# Altium project ESP32 MEGA.PrjPcb
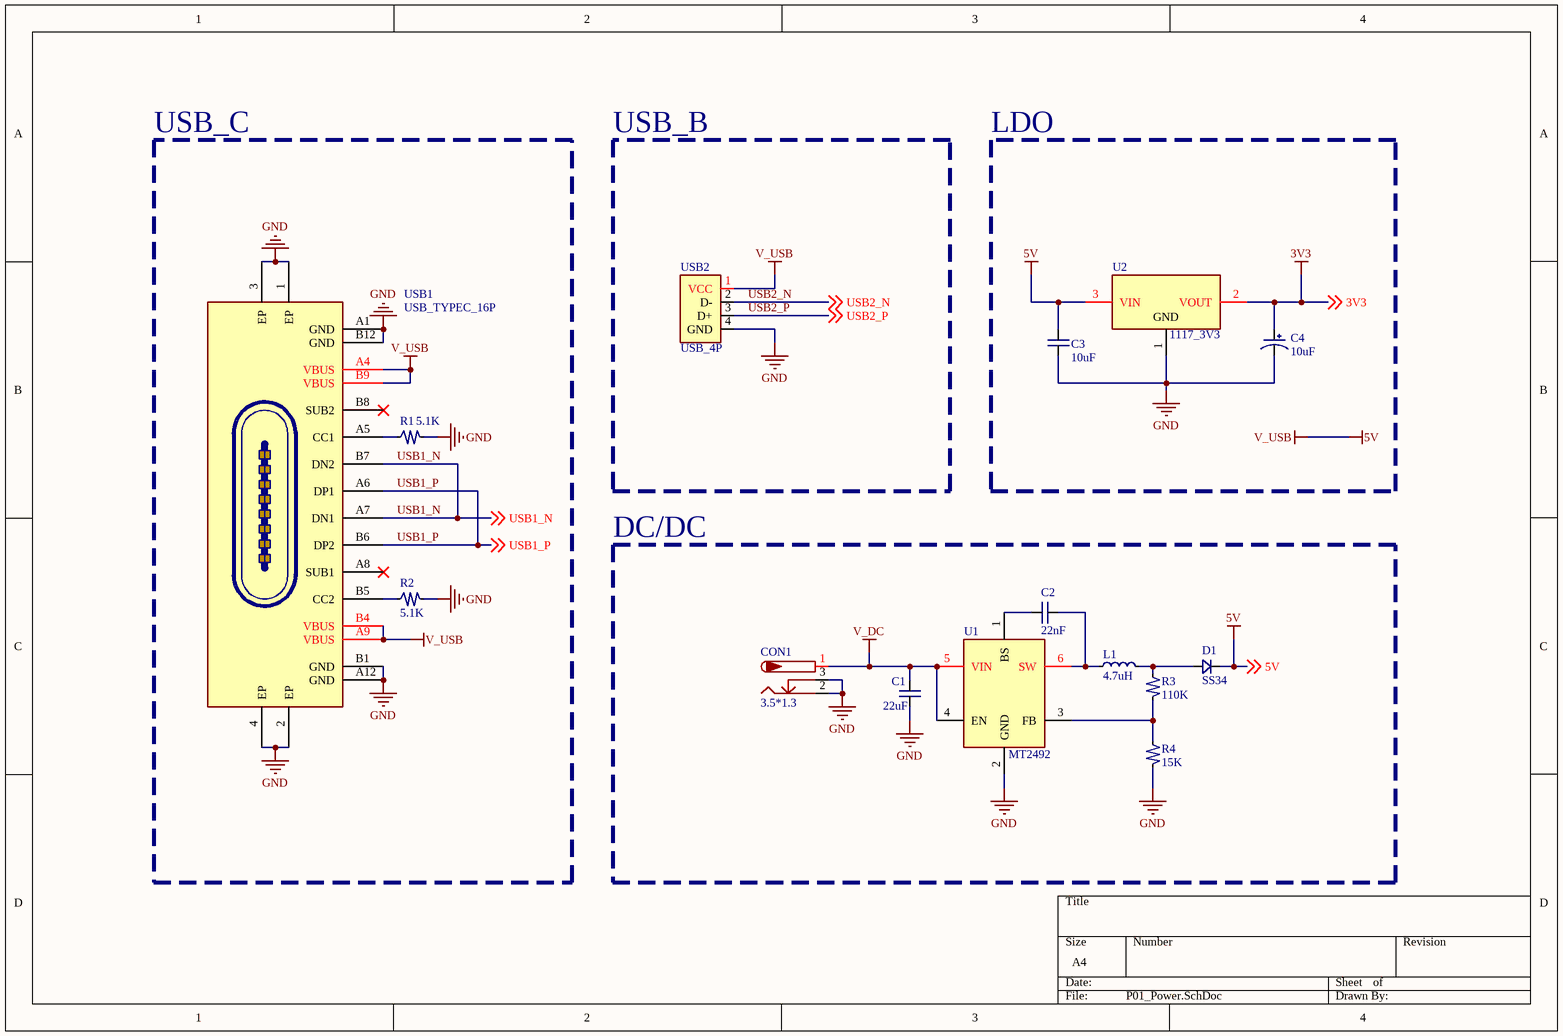
[diagram p0: P01_Power.SchDoc]
3 sheets, 64 parts. Net scope: global (net labels, ports and power ports of the same name join across sheets).
Board file: PCB.PcbDoc
Sheets:
  P01_Power.SchDoc
  P02_MCU.SchDoc
  P03_Connectors.SchDoc

## Sheet P01_Power.SchDoc
size A4; SheetNumber: 1; SheetTotal: 3

### Parts
C1  22uF  [C_0603]
C2  22nF  [C_0603]
C3  10uF  [C_0805]
C4  10uF  [CASE-A-3216]
CON1  3.5*1.3  [DC_Input]
D1  SS34  [SMA]
L1  4.7uH  [L_SMD0420]
R1  5.1K  [R_0402]
R2  5.1K  [R_0402]
R3  110K  [R_0603]
R4  15K  [R_0603]
U1  MT2492  [SOT-23-6]
U2  1117_3V3  [SOT-223]
USB1  USB_TYPEC_16P  [USB_TYPEC_16P]
USB2  USB_4P  [USB_TYPEB_4P]

### Blocks framed on the sheet
USB_C: R1 R2 USB1
USB_B: USB2
LDO: C3 C4 U2
DC/DC: C1 C2 CON1 D1 L1 R3 R4 U1

### Nets
3V3: C4.1 U2.2(VOUT) ; off-sheet 3V3
5V: C3.1 D1.1 U2.3(VIN) USB1.A4(VBUS) USB1.A9(VBUS) USB1.B4(VBUS) USB1.B9(VBUS) USB2.1(VCC) ; off-sheet 5V  [also labelled V_USB]
GND: C1.1 C3.2 C4.2 CON1.2 CON1.3 R1.1 R2.1 R4.1 U1.2(GND) U2.1(GND) USB1.1(EP) USB1.2(EP) USB1.3(EP) USB1.4(EP) USB1.A1(GND) USB1.A12(GND) USB1.B1(GND) USB1.B12(GND) USB2.4(GND)
V_DC: C1.2 CON1.1 U1.4(EN) U1.5(VIN)
USB1_N: USB1.A7(DN1) USB1.B7(DN2) ; off-sheet USB1_N  [project net GPIO19]
USB1_P: USB1.A6(DP1) USB1.B6(DP2) ; off-sheet USB1_P  [project net GPIO20]
USB2_N: USB2.2(D-) ; off-sheet USB2_N
USB2_P: USB2.3(D+) ; off-sheet USB2_P
NetC2_1: C2.1 U1.1(BS)
NetC2_2: C2.2 L1.2 U1.6(SW)
NetD1_2: D1.2 L1.1 R3.2
NetR1_2: R1.2 USB1.A5(CC1)
NetR2_2: R2.2 USB1.B5(CC2)
NetR3_1: R3.1 R4.2 U1.3(FB)

Not connected (* = marked no-connect by the designer): USB1 A8(SUB1)* B8(SUB2)*

### Library data of the parts
C1-C3 = C: 无极性电容
C4 = C_P: 极性电容
CON1 = DC_Input: 低压电源接口
D1 = D: 二极管
L1 = L: 电感
R1-R4 = R: 电阻
U1 = MT2492: 降压DC/DC / https://atta.szlcsc.com/upload/public/pdf/source/20221209/5C81DA9662873D3A116170FFBF63E49D.pdf
U2 = 1117_3V3: LDO to 3V3
USB1 = USB_TYPEC_16P: USB母座，TYPEC，16P
USB2 = USB_4Pin: USB母座, 4P

## Sheet P02_MCU.SchDoc
size A4; SheetNumber: 2; SheetTotal: 3
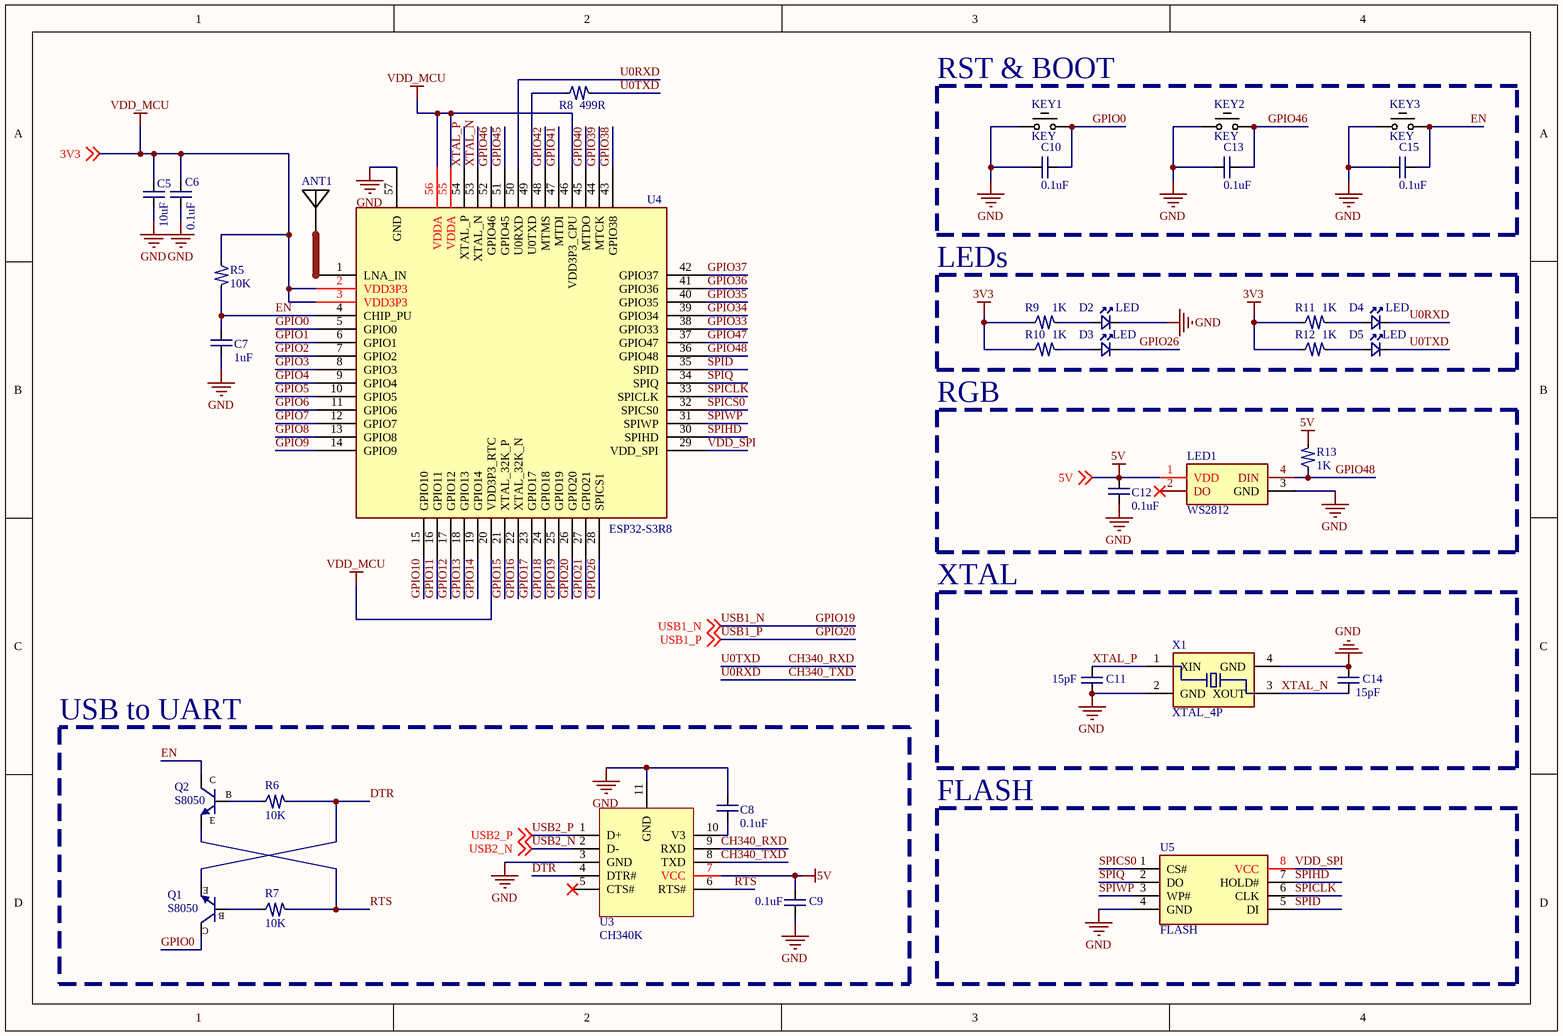
[diagram p1: P02_MCU.SchDoc]

### Parts
ANT1  ANT  [CrossAir_CAC03]  (value not drawn)
C5  10uF  [C_0402]
C6  0.1uF  [C_0402]
C7  1uF  [C_0402]
C8  0.1uF  [C_0603]
C9  0.1uF  [C_0603]
C10  0.1uF  [C_0603]
C11  15pF  [C_0402]
C12  0.1uF  [C_0603]
C13  0.1uF  [C_0603]
C14  15pF  [C_0402]
C15  0.1uF  [C_0603]
D2  LED  [LED_0603]
D3  LED  [LED_0603]
D4  LED  [LED_0603]
D5  LED  [LED_0603]
KEY1  KEY  [KEY]
KEY2  KEY  [KEY]
KEY3  KEY  [KEY]
LED1  WS2812  [SMD5050]
Q1  S8050  [SOT-23-3]
Q2  S8050  [SOT-23-3]
R5  10K  [R_0402]
R6  10K  [R_0603]
R7  10K  [R_0603]
R8  499R  [R_0402]
R9  1K  [R_0603]
R10  1K  [R_0603]
R11  1K  [R_0603]
R12  1K  [R_0603]
R13  1K  [R_0603]
U3  CH340K  [ESOP-10]
U4  ESP32-S3R8  [QFN-56]
U5  FLASH  [SOIC-8-208mil]
X1  XTAL_4P  [X_SMD3225]

### Blocks framed on the sheet
RST & BOOT: C10 C13 C15 KEY1-KEY3
LEDs: D2-D5 R9-R12
RGB: C12 LED1 R13
XTAL: C11 C14 X1
USB to UART: C8 C9 Q1 Q2 R6 R7 U3
FLASH: U5

### Nets
3V3: C5.1 C6.1 R5.2 R9.2 R10.2 R11.2 R12.2 U4.2(VDD3P3) U4.3(VDD3P3) U4.20(VDD3P3_RTC) U4.46(VDD3P3_CPU) U4.55(VDDA) U4.56(VDDA) ; off-sheet 3V3  [also labelled VDD_MCU]
5V: C9.2 C12.2 LED1.1(VDD) R13.1 U3.7(VCC) ; off-sheet 5V
GND: C5.2 C6.2 C7.1 C8.1 C9.1 C10.2 C11.1 C12.1 C13.2 C14.2 C15.2 D2.1 KEY1.2 KEY2.2 KEY3.2 LED1.3(GND) U3.3(GND) U3.11(GND) U4.57(GND) U5.4(GND) X1.2(GND) X1.4(GND)
CH340_RXD: D5.1 R8.1 U3.9(RXD)  [also labelled U0TXD]
CH340_TXD: D4.1 U3.8(TXD) U4.50(U0RXD)  [also labelled U0RXD]
DTR: Q1.2(E) R6.1 U3.4(DTR#)
EN: C7.2 C15.1 KEY3.1 Q2.3(C) R5.1 U4.4(CHIP_PU)
GPIO0: C10.1 KEY1.1 Q1.3(C) U4.5(GPIO0)
GPIO1: U4.6(GPIO1)
GPIO2: U4.7(GPIO2)
GPIO3: U4.8(GPIO3)
GPIO4: U4.9(GPIO4)
GPIO5: U4.10(GPIO5)
GPIO6: U4.11(GPIO6)
GPIO7: U4.12(GPIO7)
GPIO8: U4.13(GPIO8)
GPIO9: U4.14(GPIO9)
GPIO10: U4.15(GPIO10)
GPIO11: U4.16(GPIO11)
GPIO12: U4.17(GPIO12)
GPIO13: U4.18(GPIO13)
GPIO14: U4.19(GPIO14)
GPIO15: U4.21(XTAL_32K_P)
GPIO16: U4.22(XTAL_32K_N)
GPIO17: U4.23(GPIO17)
GPIO18: U4.24(GPIO18)
GPIO19: U4.25(GPIO19) ; off-sheet USB1_N  [also labelled USB1_N]
GPIO20: U4.26(GPIO20) ; off-sheet USB1_P  [also labelled USB1_P]
GPIO21: U4.27(GPIO21)
GPIO26: D3.1 U4.28(SPICS1)
GPIO33: U4.38(GPIO33)
GPIO34: U4.39(GPIO34)
GPIO35: U4.40(GPIO35)
GPIO36: U4.41(GPIO36)
GPIO37: U4.42(GPIO37)
GPIO38: U4.43(GPIO38)
GPIO39: U4.44(MTCK)
GPIO40: U4.45(MTDO)
GPIO41: U4.47(MTDI)
GPIO42: U4.48(MTMS)
GPIO45: U4.51(GPIO45)
GPIO46: C13.1 KEY2.1 U4.52(GPIO46)
GPIO47: U4.37(GPIO47)
GPIO48: LED1.4(DIN) R13.2 U4.36(GPIO48)
RTS: Q2.2(E) R7.1 U3.6(RTS#)
SPICLK: U4.33(SPICLK) U5.6(CLK)
SPICS0: U4.32(SPICS0) U5.1(CS#)
SPID: U4.35(SPID) U5.5(DI)
SPIHD: U4.30(SPIHD) U5.7(HOLD#)
SPIQ: U4.34(SPIQ) U5.2(DO)
SPIWP: U4.31(SPIWP) U5.3(WP#)
USB2_N: U3.2(D-) ; off-sheet USB2_N
USB2_P: U3.1(D+) ; off-sheet USB2_P
VDD_SPI: U4.29(VDD_SPI) U5.8(VCC)
XTAL_N: C14.1 U4.53(XTAL_N) X1.3(XOUT)
XTAL_P: C11.2 U4.54(XTAL_P) X1.1(XIN)
NetANT1_1: ANT1.1(Feed) U4.1(LNA_IN)
NetC8_2: C8.2 U3.10(V3)
NetD2_2: D2.2 R9.1
NetD3_2: D3.2 R10.1
NetD4_2: D4.2 R11.1
NetD5_2: D5.2 R12.1
NetQ1_1: Q1.1(B) R7.2
NetQ2_1: Q2.1(B) R6.2
NetR8_2: R8.2 U4.49(U0TXD)

Not connected (* = marked no-connect by the designer): LED1 2(DO)*; U3 5(CTS#)*

### Library data of the parts
ANT1 = ANT: 天线
C5-C15 = C: 无极性电容
D2-D5 = LED: 发光二极管
KEY1-KEY3 = KEY: 通用2脚按键
LED1 = WS2812: RGB
Q1 Q2 = NFET: 三极管
R5-R13 = R: 电阻
U3 = CH340K: USB-UART
U4 = ESP32-S3FN8: ESP32-S3 / SPICS1 connect to the QSPI PSRAM and / are not available for other use. / ESP32-S3-PICO-1-N8R8: / SPICS1 and IO33~IO37 connect to the OSPI / PSRAM and are not available for other use.
U5 = FLASH: NOR FLASH
X1 = XTAL_4P: 晶振 4P

## Sheet P03_Connectors.SchDoc
size A4; SheetNumber: 3; SheetTotal: 3
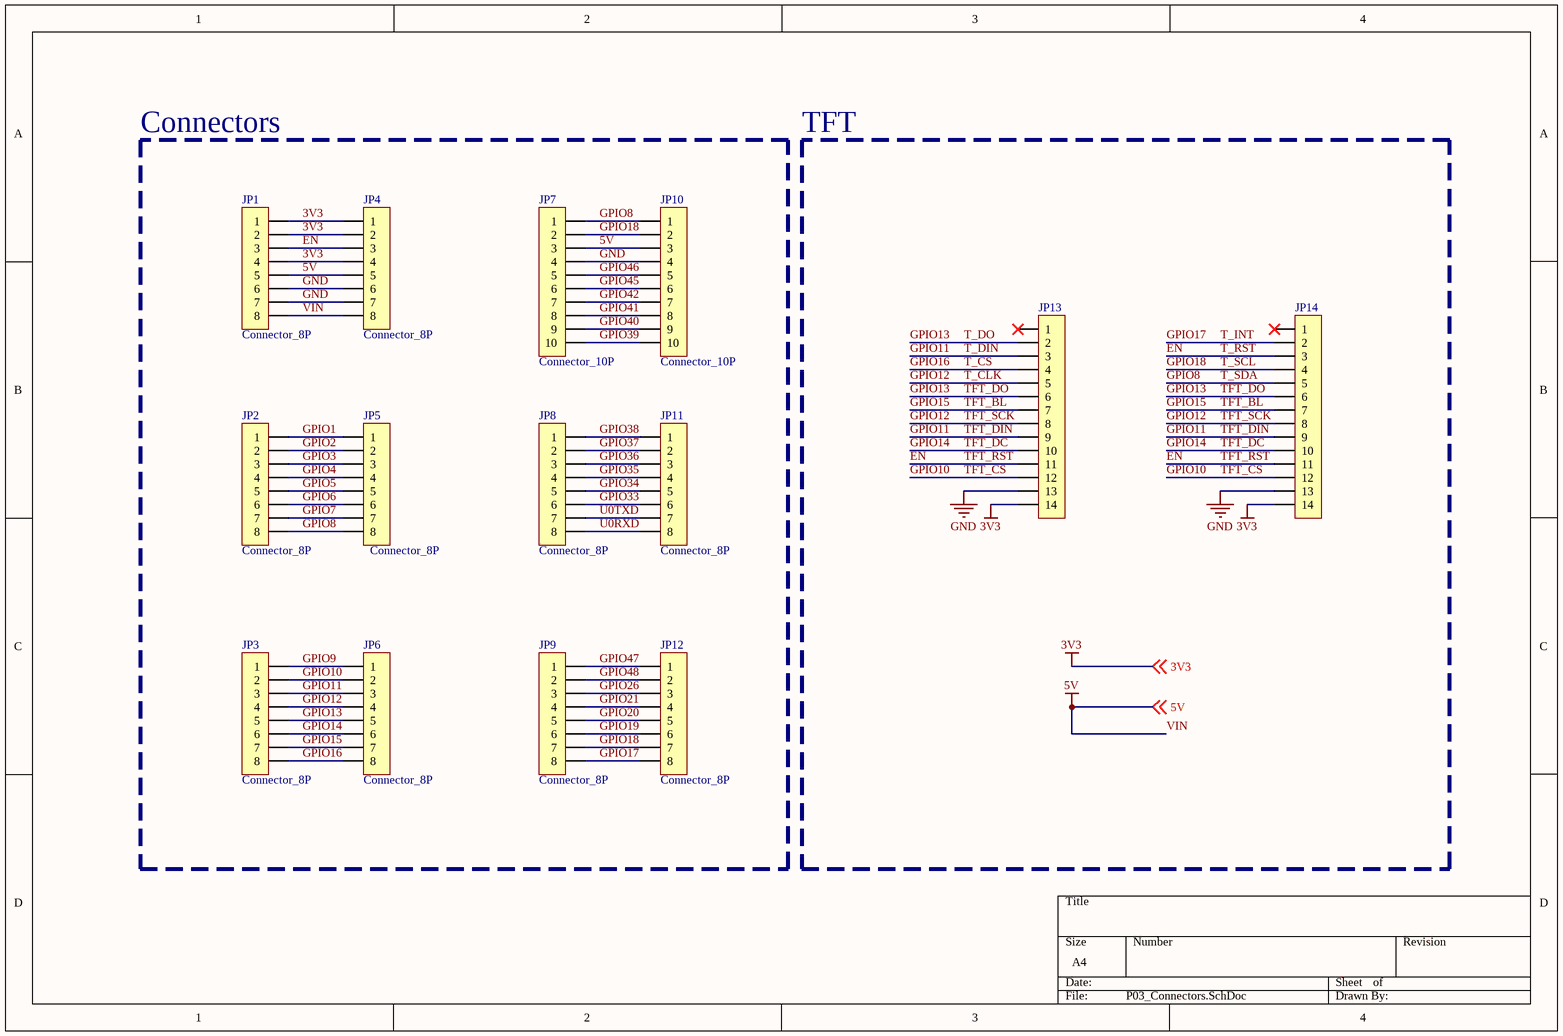
[diagram p2: P03_Connectors.SchDoc]

### Parts
JP1  Connector_8P  [排母_2.54mm_8P]
JP2  Connector_8P  [排母_2.54mm_8P]
JP3  Connector_8P  [排母_2.54mm_8P]
JP4  Connector_8P  [排针_2.54mm_8P]
JP5  Connector_8P  [排针_2.54mm_8P]
JP6  Connector_8P  [排针_2.54mm_8P]
JP7  Connector_10P  [排母_2.54mm_10P]
JP8  Connector_8P  [排母_2.54mm_8P]
JP9  Connector_8P  [排母_2.54mm_8P]
JP10  Connector_10P  [排针_2.54mm_10P]
JP11  Connector_8P  [排针_2.54mm_8P]
JP12  Connector_8P  [排针_2.54mm_8P]
JP13  HDR-1X14  [HDR2.54-M-LI-14P]  (value not drawn)
JP14  HDR-1X14  [HDR2.54-M-LI-14P]  (value not drawn)

### Blocks framed on the sheet
Connectors: JP1-JP12
TFT: JP13 JP14

### Nets
3V3: JP1.1 JP1.2 JP1.4 JP4.1 JP4.2 JP4.4 JP13.14 JP14.14 ; off-sheet 3V3
5V: JP1.5 JP1.8 JP4.5 JP4.8 JP7.3 JP10.3 ; off-sheet 5V  [also labelled VIN]
GND: JP1.6 JP1.7 JP4.6 JP4.7 JP7.4 JP10.4 JP13.13 JP14.13
EN: JP1.3 JP4.3 JP13.11 JP14.3 JP14.11  [also labelled T_RST, TFT_RST]
GPIO1: JP2.1 JP5.1
GPIO2: JP2.2 JP5.2
GPIO3: JP2.3 JP5.3
GPIO4: JP2.4 JP5.4
GPIO5: JP2.5 JP5.5
GPIO6: JP2.6 JP5.6
GPIO7: JP2.7 JP5.7
GPIO8: JP2.8 JP5.8 JP7.1 JP10.1 JP14.5  [also labelled T_SDA]
GPIO9: JP3.1 JP6.1
GPIO10: JP3.2 JP6.2 JP13.12 JP14.12  [also labelled TFT_CS]
GPIO11: JP3.3 JP6.3 JP13.3 JP13.9 JP14.9  [also labelled T_DIN, TFT_DIN]
GPIO12: JP3.4 JP6.4 JP13.5 JP13.8 JP14.8  [also labelled T_CLK, TFT_SCK]
GPIO13: JP3.5 JP6.5 JP13.2 JP13.6 JP14.6  [also labelled T_DO, TFT_DO]
GPIO14: JP3.6 JP6.6 JP13.10 JP14.10  [also labelled TFT_DC]
GPIO15: JP3.7 JP6.7 JP13.7 JP14.7  [also labelled TFT_BL]
GPIO16: JP3.8 JP6.8 JP13.4  [also labelled T_CS]
GPIO17: JP9.8 JP12.8 JP14.2  [also labelled T_INT]
GPIO18: JP7.2 JP9.7 JP10.2 JP12.7 JP14.4  [also labelled T_SCL]
GPIO19: JP9.6 JP12.6
GPIO20: JP9.5 JP12.5
GPIO21: JP9.4 JP12.4
GPIO26: JP9.3 JP12.3
GPIO33: JP8.6 JP11.6
GPIO34: JP8.5 JP11.5
GPIO35: JP8.4 JP11.4
GPIO36: JP8.3 JP11.3
GPIO37: JP8.2 JP11.2
GPIO38: JP8.1 JP11.1
GPIO39: JP7.10 JP10.10
GPIO40: JP7.9 JP10.9
GPIO41: JP7.8 JP10.8
GPIO42: JP7.7 JP10.7
GPIO45: JP7.6 JP10.6
GPIO46: JP7.5 JP10.5
GPIO47: JP9.1 JP12.1
GPIO48: JP9.2 JP12.2
U0RXD: JP8.8 JP11.8  [project net CH340_TXD]
U0TXD: JP8.7 JP11.7  [project net CH340_RXD]

Not connected (* = marked no-connect by the designer): JP13 1*; JP14 1*

### Library data of the parts
JP13 JP14 = Header 14: 14P接插件

## Nets that join several sheets
3V3: P01_Power (C4.1 U2.2), P02_MCU (13 pins), P03_Connectors (8 pins)
5V: P01_Power (8 pins), P02_MCU (5 pins), P03_Connectors (6 pins)
GND: P01_Power (19 pins), P02_MCU (22 pins), P03_Connectors (8 pins)
CH340_RXD: P02_MCU (D5.1 R8.1 U3.9), P03_Connectors (JP8.7 JP11.7)
CH340_TXD: P02_MCU (D4.1 U3.8 U4.50), P03_Connectors (JP8.8 JP11.8)
EN: P02_MCU (6 pins), P03_Connectors (5 pins)
GPIO1: P02_MCU (U4.6), P03_Connectors (JP2.1 JP5.1)
GPIO2: P02_MCU (U4.7), P03_Connectors (JP2.2 JP5.2)
GPIO3: P02_MCU (U4.8), P03_Connectors (JP2.3 JP5.3)
GPIO4: P02_MCU (U4.9), P03_Connectors (JP2.4 JP5.4)
GPIO5: P02_MCU (U4.10), P03_Connectors (JP2.5 JP5.5)
GPIO6: P02_MCU (U4.11), P03_Connectors (JP2.6 JP5.6)
GPIO7: P02_MCU (U4.12), P03_Connectors (JP2.7 JP5.7)
GPIO8: P02_MCU (U4.13), P03_Connectors (5 pins)
GPIO9: P02_MCU (U4.14), P03_Connectors (JP3.1 JP6.1)
GPIO10: P02_MCU (U4.15), P03_Connectors (JP3.2 JP6.2 JP13.12 JP14.12)
GPIO11: P02_MCU (U4.16), P03_Connectors (5 pins)
GPIO12: P02_MCU (U4.17), P03_Connectors (5 pins)
GPIO13: P02_MCU (U4.18), P03_Connectors (5 pins)
GPIO14: P02_MCU (U4.19), P03_Connectors (JP3.6 JP6.6 JP13.10 JP14.10)
GPIO15: P02_MCU (U4.21), P03_Connectors (JP3.7 JP6.7 JP13.7 JP14.7)
GPIO16: P02_MCU (U4.22), P03_Connectors (JP3.8 JP6.8 JP13.4)
GPIO17: P02_MCU (U4.23), P03_Connectors (JP9.8 JP12.8 JP14.2)
GPIO18: P02_MCU (U4.24), P03_Connectors (5 pins)
GPIO19: P01_Power (USB1.A7 USB1.B7), P02_MCU (U4.25), P03_Connectors (JP9.6 JP12.6)
GPIO20: P01_Power (USB1.A6 USB1.B6), P02_MCU (U4.26), P03_Connectors (JP9.5 JP12.5)
GPIO21: P02_MCU (U4.27), P03_Connectors (JP9.4 JP12.4)
GPIO26: P02_MCU (D3.1 U4.28), P03_Connectors (JP9.3 JP12.3)
GPIO33: P02_MCU (U4.38), P03_Connectors (JP8.6 JP11.6)
GPIO34: P02_MCU (U4.39), P03_Connectors (JP8.5 JP11.5)
GPIO35: P02_MCU (U4.40), P03_Connectors (JP8.4 JP11.4)
GPIO36: P02_MCU (U4.41), P03_Connectors (JP8.3 JP11.3)
GPIO37: P02_MCU (U4.42), P03_Connectors (JP8.2 JP11.2)
GPIO38: P02_MCU (U4.43), P03_Connectors (JP8.1 JP11.1)
GPIO39: P02_MCU (U4.44), P03_Connectors (JP7.10 JP10.10)
GPIO40: P02_MCU (U4.45), P03_Connectors (JP7.9 JP10.9)
GPIO41: P02_MCU (U4.47), P03_Connectors (JP7.8 JP10.8)
GPIO42: P02_MCU (U4.48), P03_Connectors (JP7.7 JP10.7)
GPIO45: P02_MCU (U4.51), P03_Connectors (JP7.6 JP10.6)
GPIO46: P02_MCU (C13.1 KEY2.1 U4.52), P03_Connectors (JP7.5 JP10.5)
GPIO47: P02_MCU (U4.37), P03_Connectors (JP9.1 JP12.1)
GPIO48: P02_MCU (LED1.4 R13.2 U4.36), P03_Connectors (JP9.2 JP12.2)
USB2_N: P01_Power (USB2.2), P02_MCU (U3.2)
USB2_P: P01_Power (USB2.3), P02_MCU (U3.1)